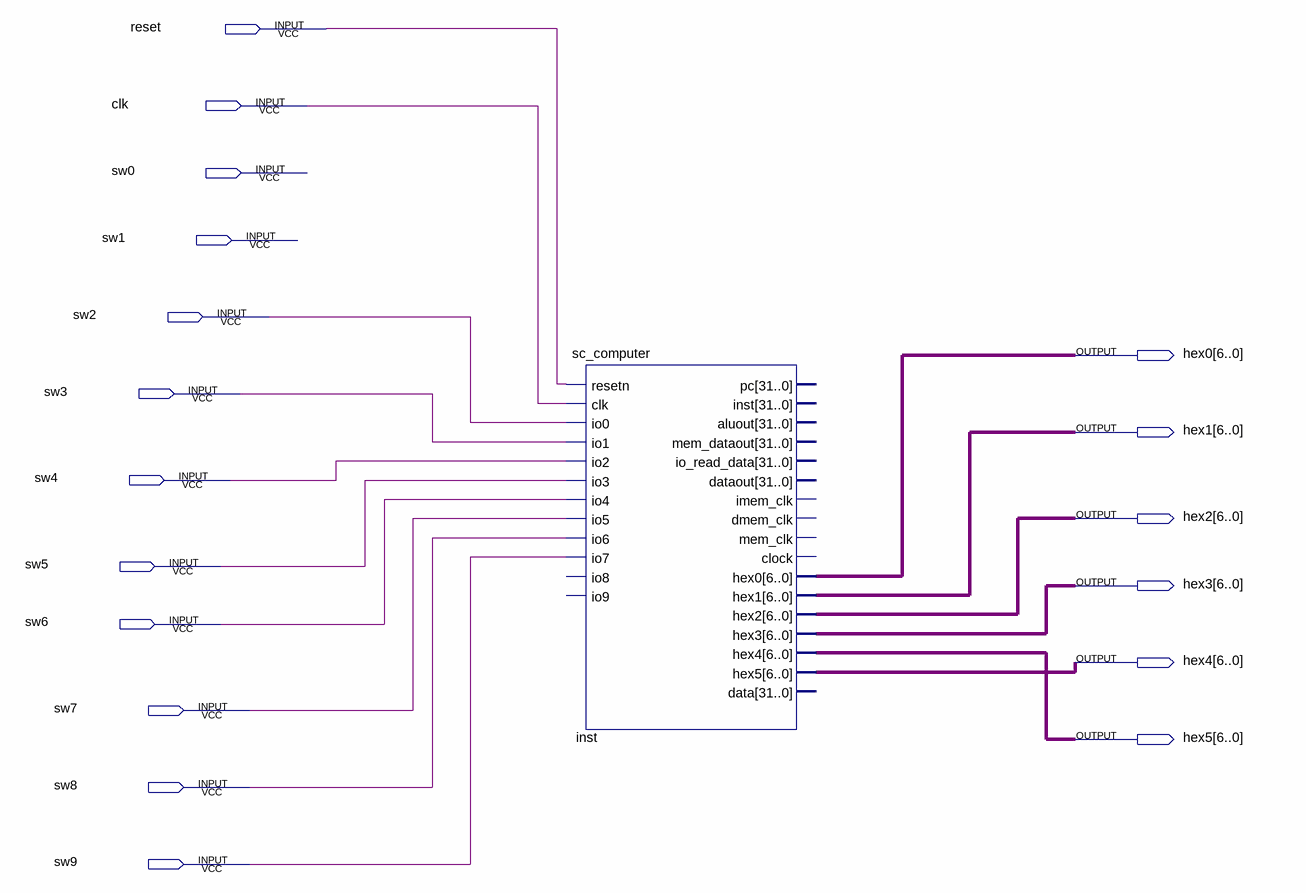
[diagram p0: schematic sheet]
// Quartus schematic cpu.bdf as structural Verilog: 1 symbols, 18 pins
module cpu (
  input  reset,
  input  clk,
  input  sw0,
  input  sw1,
  input  sw2,
  input  sw3,
  input  sw4,
  input  sw5,
  input  sw6,
  input  sw7,
  input  sw8,
  input  sw9,
  output [6:0] hex0,
  output [6:0] hex1,
  output [6:0] hex2,
  output [6:0] hex3,
  output [6:0] hex4,
  output [6:0] hex5
);

  sc_computer inst (
    .resetn(reset), .clk(clk), .io0(sw2), .io1(sw3), .io2(sw4), .io3(sw5), .io4(sw6), .io5(sw7), .io6(sw8),
    .io7(sw9), .hex0(hex0), .hex1(hex1), .hex2(hex2), .hex3(hex3), .hex4(hex5), .hex5(hex4));  // open: io8, io9, pc, inst, aluout, mem_dataout, io_read_data, dataout, imem_clk, dmem_clk, mem_clk, clock, data
endmodule
